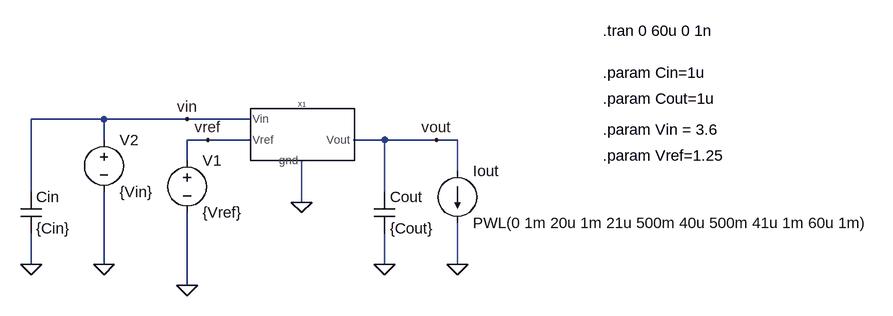
[diagram p0: schematic Load Transient_6p29.asc]
Load Transient_6p29.asc, the LTspice schematic file:
Version 4
SHEET 1 880 680
WIRE -432 32 -544 32
WIRE -304 32 -432 32
WIRE -208 32 -304 32
WIRE -432 64 -432 32
WIRE -272 64 -304 64
WIRE -208 64 -272 64
WIRE 0 64 -48 64
WIRE 80 64 0 64
WIRE 112 64 80 64
WIRE -304 96 -304 64
WIRE 112 112 112 64
WIRE -544 144 -544 32
WIRE 0 144 0 64
WIRE -128 160 -128 96
WIRE -544 256 -544 208
WIRE -432 256 -432 144
WIRE 0 256 0 208
WIRE 112 256 112 192
WIRE -304 288 -304 176
FLAG -304 288 0
FLAG -272 64 vref
FLAG -432 256 0
FLAG -304 32 vin
FLAG 0 256 0
FLAG 112 256 0
FLAG 80 64 vout
FLAG -128 160 0
FLAG -544 256 0
SYMBOL LDO_basic -128 48 R0
SYMATTR InstName X1
SYMBOL voltage -304 80 R0
WINDOW 123 0 0 Left 0
WINDOW 39 0 0 Left 0
SYMATTR InstName V1
SYMATTR Value {Vref}
SYMBOL voltage -432 48 R0
WINDOW 123 24 44 Left 2
WINDOW 39 0 0 Left 0
SYMATTR InstName V2
SYMATTR Value {Vin}
SYMBOL cap -16 144 R0
SYMATTR InstName Cout
SYMATTR Value {Cout}
SYMBOL current 112 112 R0
WINDOW 123 0 0 Left 0
WINDOW 39 0 0 Left 0
SYMATTR InstName Iout
SYMATTR Value PWL(0 1m 20u 1m 21u 500m 40u 500m 41u 1m 60u 1m)
SYMBOL cap -560 144 R0
SYMATTR InstName Cin
SYMATTR Value {Cin}
TEXT 336 -104 Left 2 !.tran 0 60u 0 1n
TEXT 336 48 Left 2 !.param Vin = 3.6
TEXT 336 0 Left 2 !.param Cout=1u
TEXT 336 -40 Left 2 !.param Cin=1u
TEXT 336 88 Left 2 !.param Vref=1.25

The netlist it stands for:
* Load Transient_6p29.asc
XX1 vin vref 0 vout LDO_basic  ; pins Vin Vref gnd Vout
V1 vref 0 {Vref}
V2 vin 0 {Vin}
Cout vout 0 {Cout}
Iout vout 0 PWL(0 1m 20u 1m 21u 500m 40u 500m 41u 1m 60u 1m)
Cin vin 0 {Cin}
.tran 0 60u 0 1n
.param Vin = 3.6
.param Cout=1u
.param Cin=1u
.param Vref=1.25
.backanno
.end